# Altium schematic sheet Power.SchDoc
size A4
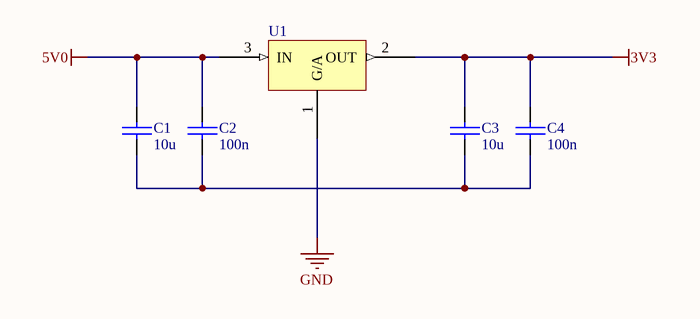
[diagram p0: Power.SchDoc]

## Parts
C1  10u  [C0805]
C2  100n  [C0603]
C3  10u  [C0805]
C4  100n  [C0603]
U1  AMS1117-XX  [SOT223]  (value not drawn)

## Nets
3V3: C3.1 C4.1 U1.2(OUT)
5V0: C1.1 C2.1 U1.3(IN)
GND: U1.1(G/A)
NetC1_2: C1.2 C2.2 C3.2 C4.2

## Library data of the parts
C1-C4 = Capacitor: 电容
U1 = AMS1117-XX: 稳压芯片